# Altium schematic sheet Digital_Clock.SchDoc
size A4; SheetNumber: 1; SheetTotal: 3
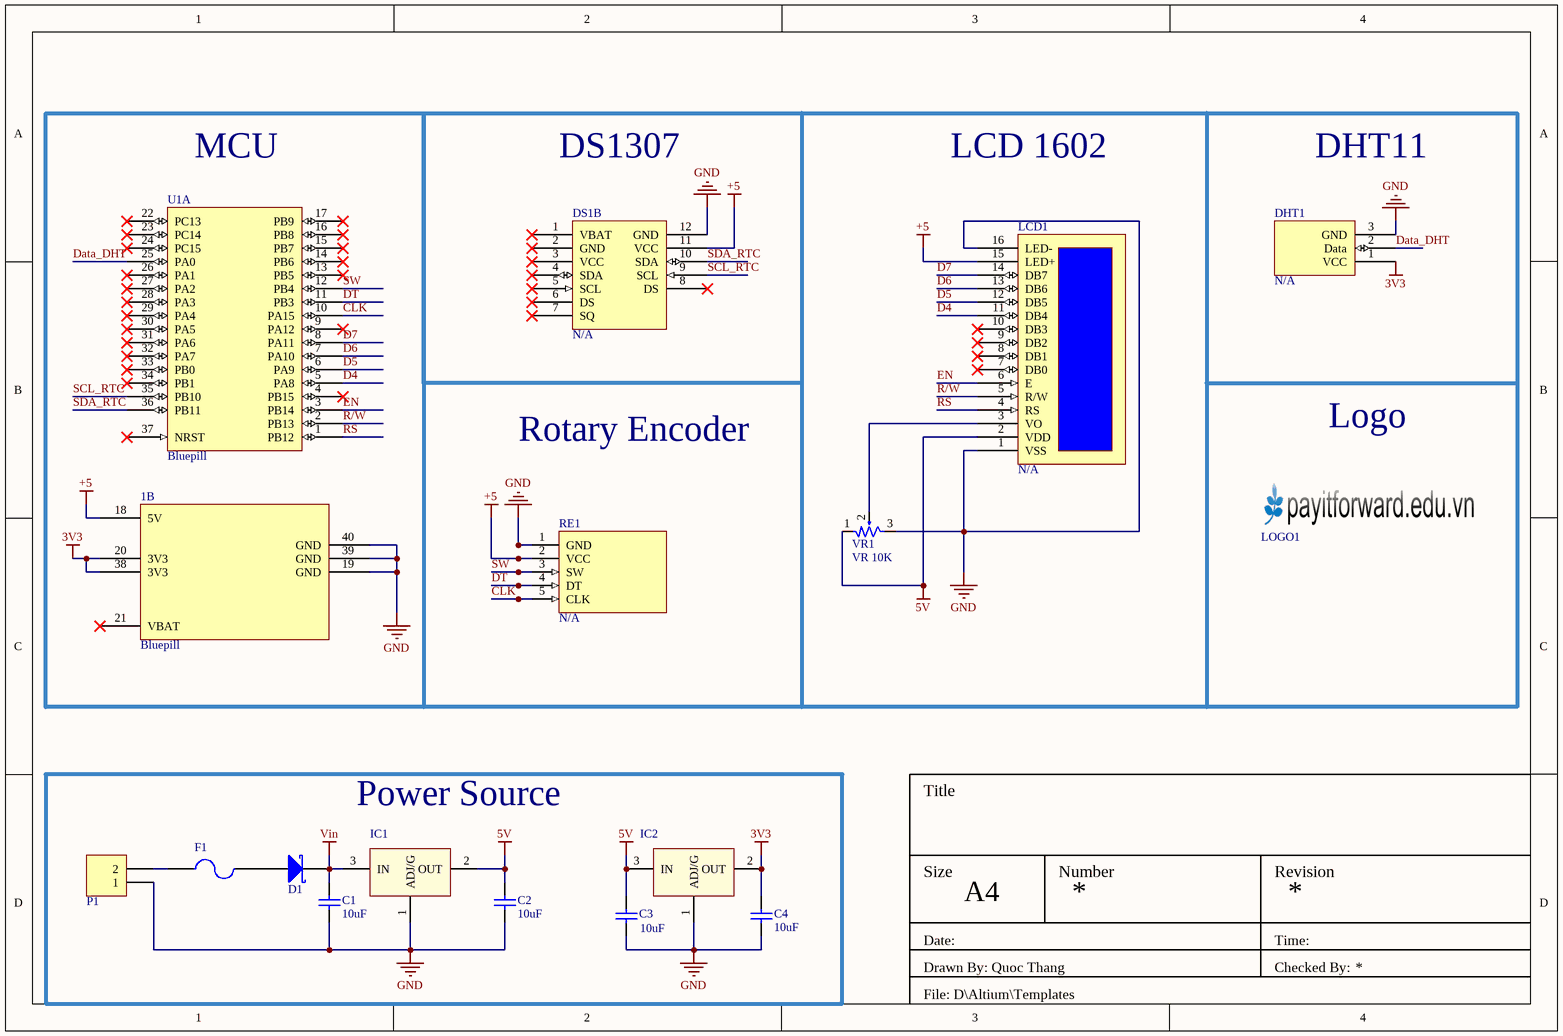
[diagram p0: Digital_Clock.SchDoc]

## Parts
1  Bluepill  [STM32F103C8T6]  (part B of 2)
C1  value 10uF  [CAP-SM-0805]  (hidden comment: Cap Non-Pol SMD)
C2  value 10uF  [CAP-SM-0805]  (hidden comment: Cap Non-Pol SMD)
C3  value 10uF  [CAP-SM-0805]  (hidden comment: Cap Non-Pol SMD)
C4  value 10uF  [CAP-SM-0805]  (hidden comment: Cap Non-Pol SMD)
D1  D Schottky  [SS34]  (value not drawn)
DHT1  N/A  [DHT11]
DS1  N/A  [DS1307]  (part B of 2)
F1  Fuse  [FUSE SMD]  (value not drawn)
IC1  LM1117  [SOT223-4N]  (value not drawn)
IC2  LM1117  [SOT223-4N]  (value not drawn)
LCD1  N/A  [LCD1602]
LOGO1  LOGO PIF  [PIF LOGO SMALL TOP]  (value not drawn)
P1  Domino 2  [DOMINO 2- 5mm]  (value not drawn)
RE1  N/A  [Rotary_Encoder]
U1  Bluepill  [STM32F103C8T6]  (part A of 2)
VR1  value VR 10K  [Varistor 1]  (hidden comment: 10K)

## Blocks framed on the sheet
MCU: 1 U1
DS1307: DS1
Power Source: C1-C4 D1 F1 IC1 IC2 P1

## Nets
3V3: 1.20(3V3) 1.38(3V3) C4.2 DHT1.1(VCC) IC2.2(OUT)
5V: C2.2 C3.2 IC1.2(OUT) IC2.3(IN) LCD1.2(VDD) VR1.1
+5: 1.18(5V) DS1.11(VCC) LCD1.15(LED+) RE1.2(VCC)
GND: 1.19(GND) 1.39(GND) 1.40(GND) C1.1 C2.1 C3.1 C4.1 DHT1.3(GND) DS1.12(GND) IC1.1(ADJ/G) IC2.1(ADJ/G) LCD1.1(VSS) LCD1.16(LED-) P1.1 RE1.1(GND) VR1.3
Vin: C1.2 D1.2(K) IC1.3(IN)
CLK: RE1.5(CLK) U1.10(PA15)
D4: LCD1.11(DB4) U1.5(PA8)
D5: LCD1.12(DB5) U1.6(PA9)
D6: LCD1.13(DB6) U1.7(PA10)
D7: LCD1.14(DB7) U1.8(PA11)
Data_DHT: DHT1.2(Data) U1.25(PA0)
DT: RE1.4(DT) U1.11(PB3)
EN: LCD1.6(E) U1.3(PB14)
R/W: LCD1.5(R/W) U1.2(PB13)
RS: LCD1.4(RS) U1.1(PB12)
SCL_RTC: DS1.9(SCL) U1.35(PB10)
SDA_RTC: DS1.10(SDA) U1.36(PB11)
SW: RE1.3(SW) U1.12(PB4)
NetD1_1: D1.1(A) F1.2
NetF1_1: F1.1 P1.2
NetLCD1_3: LCD1.3(VO) VR1.2

Not connected (* = marked no-connect by the designer): 1 21(VBAT)*; DS1 1(VBAT)* 2(GND)* 3(VCC)* 4(SDA)* 5(SCL)* 6(DS)* 7(SQ)* 8(DS)*; LCD1 7(DB0)* 8(DB1)* 9(DB2)* 10(DB3)*; U1 4(PB15)* 9(PA12)* 13(PB5)* 14(PB6)* 15(PB7)* 16(PB8)* 17(PB9)* 22(PC13)* 23(PC14)* 24(PC15)* 26(PA1)* 27(PA2)* 28(PA3)* 29(PA4)* 30(PA5)* 31(PA6)* 32(PA7)* 33(PB0)* 34(PB1)* 37(NRST)*

## Notes on the sheet
- LCD 1602
- DHT11
- Rotary Encoder
- Logo
- Title
- Size
- A4
- Number
- Revision
- Date:
- Drawn By: Quoc Thang
- Time:
- Checked By:
- File: D\Altium\Templates

## Library data of the parts
1 U1 = STM32F103C8T6: STM32F103C8T6, mbed-Enabled Development Bluepill STM32F1 ARM® Cortex®-M3 MCU 32-Bit Embedded Evaluation Board; Manufacturer: STMicroelectronics; Core Size: 32-Bit Single-Core; Speed: 72MHz; Connectivity: CANbus, I²C, IrDA, LINbus, SPI, UART/USART, USB; Peripherals: DMA, Motor Control PWM, PDR, POR, PVD, PWM, Temp Sensor, WDT; Number of I/O: 37; Program Memory Size: 64KB (64K x 8); Program Memory Type: FLASH; RAM Size: 20K x 8; Voltage - Supply (Vcc/Vdd): 2V ~ 3.6V; Data Converters: A/D 10x12b; Oscillator Type: Internal; Series: STM32F1; Core Processor: ARM® Cortex®-M3; Operating Temperature: 40°C ~ 85°C (TA); Mounting Type: Surface Mount; Package / Case: 48-LQFP; Base Product Number: STM32F103; ComponentLink1Description: MPU; ComponentLink1URL: https://www.thegioiic.com/stm32f103c8t6; ComponentLink2Description: Kit Bluepill; ComponentLink2URL: https://hshop.vn/products/kit-ra-chon-stm32f103c8t6; ComponentLink3Description: Datasheet; ComponentLink3URL: https://www.st.com/resource/en/datasheet/cd00161566.pdf
C1-C4 = Cap Non-Pol SMD: Capacitor
D1 = D Schottky: Schottky Diode; Published: 8-Jun-2000; LatestRevisionDate: 17-Jul-2002; LatestRevisionNote: Re-released for DXP Platform.; PackageReference: SMB; Publisher: Altium Limited; PackageDescription: DO-214-AA/SMB; 2 C-Bend Leads; Body 5.3 x 3.6 mm, inc. leads (LxW); Code_JEDEC: DO-214-AA
DHT1 = DHT11: Temperature Humidity Sensor 16bi; Manufacturer: UNIVERSAL-SOLDER Electronics Ltd; Product Status: Active; Sensor Type: Humidity, Temperature; Output Type: Digital; Output: 16b; Accuracy: ±5% RH; Voltage - Supply: 3.5V ~ 5.5V; ComponentLink1Description: Datasheet; ComponentLink1URL: https://www.mouser.com/datasheet/2/758/DHT11-Technical-Data-Sheet-Translated-Version-1143054.pdf; ComponentLink2Description: Thegioiic; ComponentLink2URL: https://www.thegioiic.com/dht11-mach-cam-bien-nhiet-do-va-do-am-den; Package: Bulk; Mounting Type: Through Hole; Package / Case: 3-SIP Module
DS1 = DS1307: IC RTC CLOCK/CALENDAR I2C 8DIP; Manufacturer: Analog Devices Inc./Maxim Integrated; Product Status: Obsolete; Memory Size: 56B; Time Format: HH:MM:SS (12/24 hr); Date Format: YY-MM-DD-dd; Interface: I²C, 2-Wire Serial; Voltage - Supply: 4.5V ~ 5.5V; Voltage - Supply, Battery: 2V ~ 3.5V; Current - Timekeeping (Max): 200µA @ 5V; Package: Tube; Type: Clock/Calendar; Features: Leap Year, NVSRAM, Square Wave Output; Operating Temperature: 0°C ~ 70°C; Mounting Type: Through Hole; Package / Case: 8-DIP (0.300", 7.62mm); Supplier Device Package: 8-PDIP; Base Product Number: DS1307; ComponentLink1Description: Datasheet; ComponentLink1URL: https://www.sparkfun.com/datasheets/Components/DS1307.pdf; ComponentLink2Description: Thegioiic; ComponentLink2URL: https://www.thegioiic.com/ds1307-ic-rtc-clock-calendar-56b-8-dip
IC1 IC2 = LM1117: Available in 1.8V, 2.5V, 2.85V, 3.3V, 5V, and  Adjustable Versions; Value: LM317
LCD1 = LCD1602: BLUE LCD 1602 2x16 Character Mat; Manufacturer: UNIVERSAL-SOLDER Electronics Ltd; Product Status: Active; Number of Characters: 32; Display Format: 16 x 2; Character Format: 5 x 8 Dots; Display Type: STN - Super-Twisted Nematic; Character Size: 5.15mm H x 2.90mm W; Outline L x W x H: 80.00mm x 36.00mm x 11.00mm; Viewing Area: 55.70mm L x 11.00mm W; Backlight: LED - Yellow/Green; Voltage - Supply: 4.5V ~ 5.5V; Dot Size: 0.55mm W x 0.65mm H; Controller Type: HD44780; Text Color: White; Package: Bag; Operating Temperature: -20°C ~ 70°C; Background Color: Blue; ComponentLink1Description: Hshop; ComponentLink1URL: https://hshop.vn/products/lcd-text-lcd1602-xanh-lo; ComponentLink2Description: Datasheet; ComponentLink2URL: https://www.waveshare.com/datasheet/LCD_en_PDF/LCD1602.pdf
P1 = Domino 2: Domino, 2-Pin; LatestRevisionDate: 17-Jul-2002; LatestRevisionNote: Re-released for DXP Platform.; Publisher: Altium Limited
RE1 = Rotary Encoder: ROTARY ENCODER MECHANICAL 16PPR; Manufacturer: CUI Devices; Product Status: Obsolete; Output Type: Quadrature (Incremental); Pulses per Revolution: 16; Voltage - Supply: 5V; Actuator Type: 6mm Dia Flatted End; Detent: Yes; Rotational Life (Cycles Min): 500K; Series: RME12; Encoder Type: Mechanical; Built in Switch: Yes; Mounting Type: Panel, PCB Through Hole; Orientation: Vertical; Termination Style: PC Pin; ComponentLink1Description: Hshop; ComponentLink1URL: https://hshop.vn/products/mach-volume-xoay-encoder; ComponentLink2Description: Datasheet; ComponentLink2URL: http://handsontec.com/dataspecs/module/Rotary%20Encoder.pdf
VR1 = Var Resistor